# Altium schematic sheet Raptor.SchDoc
size 292 x 193 mm; Author: Power Lin; SheetNumber: 1; SheetTotal: 1; Website: wiki-power.com
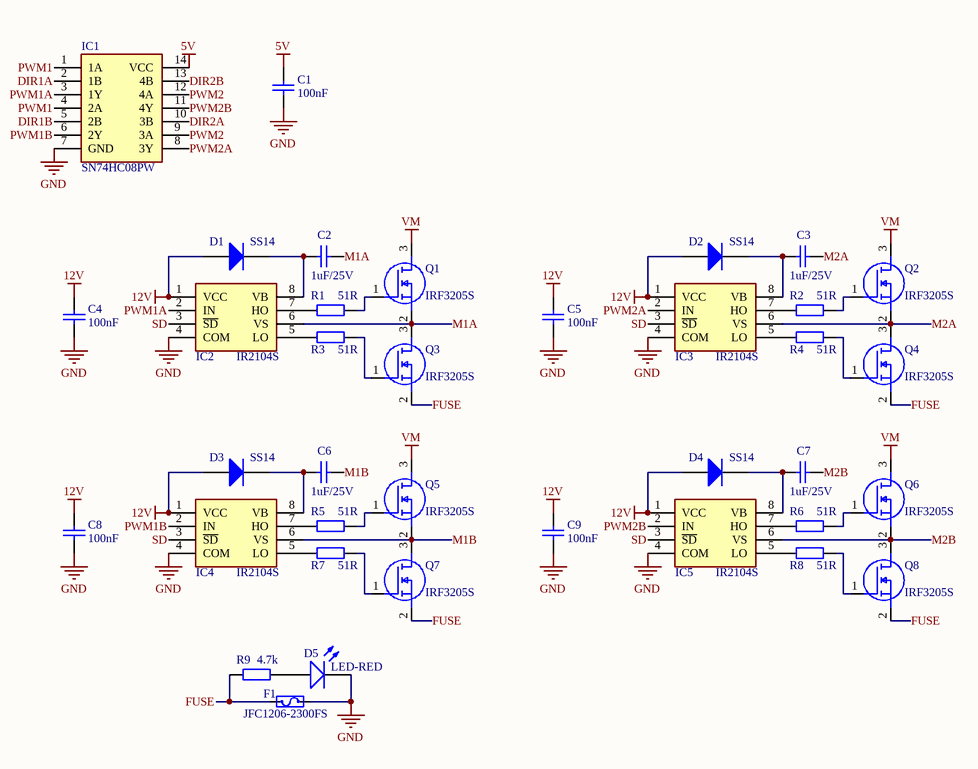
[diagram p0: Raptor.SchDoc]

## Parts
C1  100nF  [CAP-0603]
C2  1uF/25V  [CAP-0603]
C3  1uF/25V  [CAP-0603]
C4  100nF  [CAP-0603]
C5  100nF  [CAP-0603]
C6  1uF/25V  [CAP-0603]
C7  1uF/25V  [CAP-0603]
C8  100nF  [CAP-0603]
C9  100nF  [CAP-0603]
D1  SS14  [DO-214AC_SMA]
D2  SS14  [DO-214AC_SMA]
D3  SS14  [DO-214AC_SMA]
D4  SS14  [DO-214AC_SMA]
D5  LED-RED  [LED-0603]
F1  JFC1206-2300FS  [FUSE_1206]
IC1  SN74HC08PW  [TSSOP14]
IC2  IR2104S  [SOIC_8]
IC3  IR2104S  [SOIC_8]
IC4  IR2104S  [SOIC_8]
IC5  IR2104S  [SOIC_8]
Q1  IRF3205S  [D2PAK-3]
Q2  IRF3205S  [D2PAK-3]
Q3  IRF3205S  [D2PAK-3]
Q4  IRF3205S  [D2PAK-3]
Q5  IRF3205S  [D2PAK-3]
Q6  IRF3205S  [D2PAK-3]
Q7  IRF3205S  [D2PAK-3]
Q8  IRF3205S  [D2PAK-3]
R1  51R  [R-0603]
R2  51R  [R-0603]
R3  51R  [R-0603]
R4  51R  [R-0603]
R5  51R  [R-0603]
R6  51R  [R-0603]
R7  51R  [R-0603]
R8  51R  [R-0603]
R9  4.7k  [R-0603]

## Nets
5V: C1.2 IC1.14(VCC)
12V: C4.2 C5.2 C8.2 C9.2 D1.1(A) D2.1(A) D3.1(A) D4.1(A) IC2.1(VCC) IC3.1(VCC) IC4.1(VCC) IC5.1(VCC)
GND: C1.1 C4.1 C5.1 C8.1 C9.1 D5.K F1.2 IC1.7(GND) IC2.4(COM) IC3.4(COM) IC4.4(COM) IC5.4(COM)
VM: Q1.3(D) Q2.3(D) Q5.3(D) Q6.3(D)
DIR1A: IC1.2(1B)
DIR1B: IC1.5(2B)
DIR2A: IC1.10(3B)
DIR2B: IC1.13(4B)
FUSE: F1.1 Q3.2(S) Q4.2(S) Q7.2(S) Q8.2(S) R9.1
M1A: C2.2 IC2.6(VS) Q1.2(S) Q3.3(D)
M1B: C6.2 IC4.6(VS) Q5.2(S) Q7.3(D)
M2A: C3.2 IC3.6(VS) Q2.2(S) Q4.3(D)
M2B: C7.2 IC5.6(VS) Q6.2(S) Q8.3(D)
PWM1: IC1.1(1A) IC1.4(2A)
PWM1A: IC1.3(1Y) IC2.2(IN)
PWM1B: IC1.6(2Y) IC4.2(IN)
PWM2: IC1.9(3A) IC1.12(4A)
PWM2A: IC1.8(3Y) IC3.2(IN)
PWM2B: IC1.11(4Y) IC5.2(IN)
SD: IC2.3(~{SD}) IC3.3(~{SD}) IC4.3(~{SD}) IC5.3(~{SD})
NetC2_1: C2.1 D1.2(K) IC2.8(VB)
NetC3_1: C3.1 D2.2(K) IC3.8(VB)
NetC6_1: C6.1 D3.2(K) IC4.8(VB)
NetC7_1: C7.1 D4.2(K) IC5.8(VB)
NetD5_A: D5.A R9.2
NetIC2_5: IC2.5(LO) R3.1
NetIC2_7: IC2.7(HO) R1.1
NetIC3_5: IC3.5(LO) R4.1
NetIC3_7: IC3.7(HO) R2.1
NetIC4_5: IC4.5(LO) R7.1
NetIC4_7: IC4.7(HO) R5.1
NetIC5_5: IC5.5(LO) R8.1
NetIC5_7: IC5.7(HO) R6.1
NetQ1_1: Q1.1(G) R1.2
NetQ2_1: Q2.1(G) R2.2
NetQ3_1: Q3.1(G) R3.2
NetQ4_1: Q4.1(G) R4.2
NetQ5_1: Q5.1(G) R5.2
NetQ6_1: Q6.1(G) R6.2
NetQ7_1: Q7.1(G) R7.2
NetQ8_1: Q8.1(G) R8.2

## Notes on the sheet
- Author
- DocumentName
- ModifiedDate
- ProjectName
- SheetNumber
- SheetTotal
- Website
- Revision

## Library data of the parts
C1-C9 = CAP: 贴片电容; ComponentLink1Description: 供应商链接; ComponentLink1URL: http://www.szlcsc.com/product/details_53938.html; Package: 0402; Supplier: LC; SuppliersPartNumber: C52923
D1-D4 = DIODE: 二极管; ComponentLink1Description: 供应商链接; ComponentLink1URL: http://www.szlcsc.com/product/details_23178.html; Package: SMA(DO-214AC); Supplier: LC; SuppliersPartNumber: C22452
D5 = LED: 发光二极管; pin to pad: A>1 K>2; ComponentLink1Description: 供应商链接; ComponentLink1URL: http://www.szlcsc.com/product/details_2663.html; Package: 0603; Supplier: LC; SuppliersPartNumber: C2290
F1 = Fuse: 一次性贴片保险丝
IC1 = SN74HC08PW: Integrated Circuit; Manufacturer_Name: Texas Instruments; Manufacturer_Part_Number: SN74HCT08PW; Description: Texas Instruments SN74HCT08PW; Datasheet Link: http://www.ti.com/lit/gpn/SN74HCT08; Height: 1.2mm; Mouser Part Number: 595-SN74HCT08PW; Mouser Price/Stock: https://www.mouser.co.uk/ProductDetail/Texas-Instruments/SN74HCT08PW?qs=7KMwW2o1%252BmRuz7pKtn1cmg%3D%3D; Arrow Part Number: SN74HCT08PW; Arrow Price/Stock: https://www.arrow.com/en/products/sn74hct08pw/texas-instruments
IC2-IC5 = IR2104S: Integrated Circuit; Manufacturer_Name: Infineon; Description: IC GATE DRVR HALF-BRIDGE 8SOIC; Datasheet Link: http://www.infineon.com/dgdl/ir2104.pdf?fileId=5546d462533600a4015355c7c1c31671; Height: 1.75mm; Manufacturer_Part_Number: IR2104S
Q1-Q8 = N-MOS: N 沟道 MOS; Manufacturer_Name: Nexperia; Manufacturer_Part_Number: SI2302DS; Datasheet Link: https://assets.nexperia.com/documents/data-sheet/SI2302DS.pdf; Height: 1.1mm; Mouser Part Number: N/A; Mouser Price/Stock: https://www.mouser.com/Search/Refine.aspx?Keyword=N%2FA; RS Part Number: 7983053P; RS Price/Stock: http://uk.rs-online.com/web/p/products/7983053P
R1-R9 = RES: 贴片电阻; Package: 0805; Supplier: LC; SuppliersPartNumber: C17798